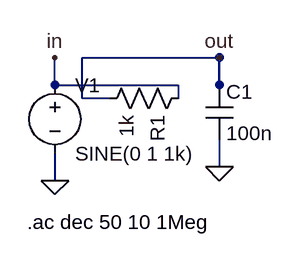
[diagram p0: schematic rc.asc]
rc.asc, the LTspice schematic file:
Version 4
SHEET 1 880 680
WIRE 128 80 272 80
WIRE 272 80 272 96
WIRE 192 96 160 96
WIRE 160 96 160 48
WIRE 160 48 320 48
WIRE 320 48 320 80
WIRE 128 80 128 48
WIRE 320 80 320 48
WIRE 128 160 128 192
WIRE 320 144 320 176
FLAG 128 48 in
FLAG 320 48 out
FLAG 128 192 0
FLAG 320 176 0
SYMBOL voltage 128 64 R0
SYMATTR InstName V1
SYMATTR Value SINE(0 1 1k)
SYMATTR Value2 AC 1
SYMBOL res 288 80 R90
SYMATTR InstName R1
SYMATTR Value 1k
SYMBOL cap 304 80 R0
SYMATTR InstName C1
SYMATTR Value 100n
TEXT 96 240 Left 2 !.ac dec 50 10 1Meg

The netlist it stands for:
* rc.asc
V1 in 0 SINE(0 1 1k) AC 1
R1 in out 1k
C1 out 0 100n
.ac dec 50 10 1Meg
.backanno
.end